# EAGLE schematic Beacon_schematic (EAGLE 9.1.3)
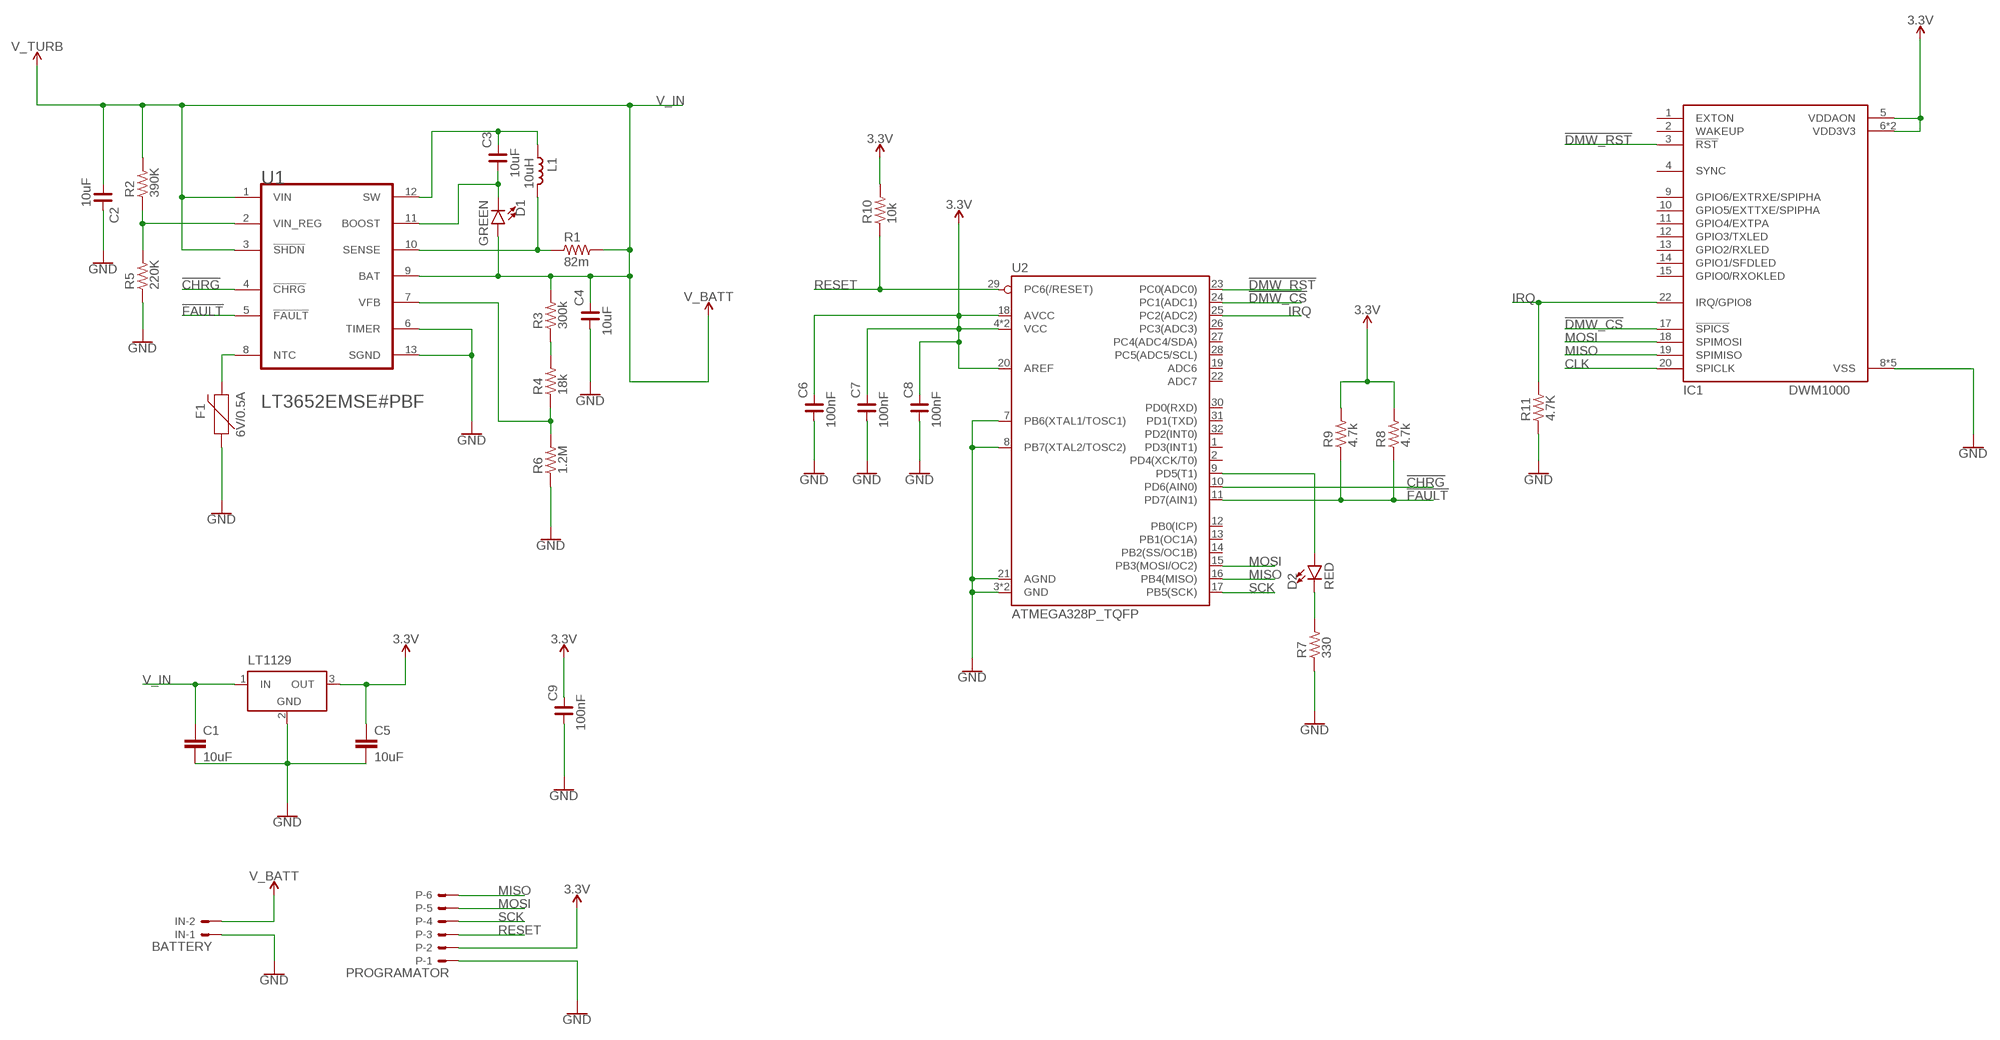
[diagram p0: schematic, sheet 1]

## Parts
C1  10uF  10UF-1206-6.3V-20%  [1206]
C2  10uF  C_1206  [C1206]
C3  10uF  C_1206  [C1206]
C4  10uF  C_1206  [C1206]
C5  10uF  10UF-1206-6.3V-20%  [1206]
C6  100nF  C_1206  [C1206]
C7  100nF  C_1206  [C1206]
C8  100nF  C_1206  [C1206]
C9  100nF  C_1206  [C1206]
D1  GREEN  LED-GREEN1206  [LED-1206]
D2  RED  LED-RED1206  [LED-1206]
F1  6V/0.5A  PPTC_HALF-AMP  [1206]
IC1  DWM1000  [DWM1000]
IN  BATTERY  JST-XH-02-PIN-LONG-PAD  [JST-XH-02-PACKAGE-LONG-PAD]
L1  10uH  L_1206  [L1206]
LT1129  LT1129CST5  [SOT223]
P  PROGRAMATOR  JST-XH-06-PIN-LONG-PAD  [JST-XH-06-PACKAGE-LONG-PAD]
R1  82m  R_1206  [R1206]
R2  390K  R_1206  [R1206]
R3  300k  R_1206  [R1206]
R4  18k  R_1206  [R1206]
R5  220K  R_1206  [R1206]
R6  1.2M  R_1206  [R1206]
R7  330  R_1206  [R1206]
R8  4.7k  R_1206  [R1206]
R9  4.7k  R_1206  [R1206]
R10  10k  R_1206  [R1206]
R11  4.7K  R_1206  [R1206]
U1  LINEAR_TECHNOLOGY_LT3652EMSE#PBFLINEAR_TECHNOLOGY_LT3652EMSE#PBF_0_2  [LINEAR_TECHNOLOGY_LT3652EMSE#PBF_2]
U2  ATMEGA328P_TQFP  [TQFP32-08]

## Nets
3.3V: C5.1 C6.2 C7.2 C8.2 C9.2 IC1.5(VDDAON) IC1.6(VDD3V3) IC1.7(VDD3V3) LT1129.3(OUT) P.2 R8.2 R9.2 R10.2 U2.4(VCC) U2.6(VCC) U2.18(AVCC) U2.20(AREF)
!CHRG: U1.4(!CHRG!) U2.10(PD6(AIN0))
!DMW_CS: IC1.17(!SPICS) U2.24(PC1(ADC1))
!DMW_RST: IC1.3(!RST) U2.23(PC0(ADC0))
!FAULT: R8.1 R9.1 U1.5(!FAULT!) U2.11(PD7(AIN1))
CLK: IC1.20(SPICLK)
GND: C1.2 C2.2 C4.1 C5.2 C6.1 C7.1 C8.1 C9.1 F1.1 IC1.8(VSS) IC1.16(VSS) IC1.21(VSS) IC1.23(VSS) IC1.24(VSS) IN.1 LT1129.2(GND) P.1 R5.1 R6.1 R7.1 R11.1 U1.6(TIMER) U1.13(SGND) U2.3(GND) U2.5(GND) U2.7(PB6(XTAL1/TOSC1)) U2.8(PB7(XTAL2/TOSC2)) U2.21(AGND)
IRQ: IC1.22(IRQ/GPIO8) R11.2 U2.25(PC2(ADC2))
MISO: IC1.19(SPIMISO) P.6 U2.16(PB4(MISO))
MOSI: IC1.18(SPIMOSI) P.5 U2.15(PB3(MOSI/OC2))
N$1: C3.2 L1.2 U1.12(SW)
N$2: C3.1 D1.C U1.11(BOOST)
N$3: D2.C R7.2
N$4: R4.1 R6.2 U1.7(VFB)
N$5: R3.1 R4.2
N$6: L1.1 R1.1 U1.10(SENSE)
N$8: F1.2 U1.8(NTC)
N$9: R2.1 R5.2 U1.2(VIN_REG)
N$12: D2.A U2.9(PD5(T1))
RESET: P.3 R10.1 U2.29(PC6(/RESET))
SCK: P.4 U2.17(PB5(SCK))
V_IN: C1.1 C2.1 C4.2 D1.A LT1129.1(IN) R1.2 R2.2 R3.2 U1.1(VIN) U1.3(!SHDN!) U1.9(BAT) ; supply symbol labelled V_TURB, V_BATT
VCC: IN.2 ; supply symbol labelled V_BATT
Unconnected: IC1.1(EXTON) IC1.2(WAKEUP) IC1.4(SYNC) IC1.9(GPIO6/EXTRXE/SPIPHA) IC1.10(GPIO5/EXTTXE/SPIPHA) IC1.11(GPIO4/EXTPA) IC1.12(GPIO3/TXLED) IC1.13(GPIO2/RXLED) IC1.14(GPIO1/SFDLED) IC1.15(GPIO0/RXOKLED) U2.1(PD3(INT1)) U2.2(PD4(XCK/T0)) U2.12(PB0(ICP)) U2.13(PB1(OC1A)) U2.14(PB2(SS/OC1B)) U2.19(ADC6) U2.22(ADC7) U2.26(PC3(ADC3)) U2.27(PC4(ADC4/SDA)) U2.28(PC5(ADC5/SCL)) U2.30(PD0(RXD)) U2.31(PD1(TXD)) U2.32(PD2(INT0))

## Power pins joined to a net without a drawn wire
GND: LT1129.4(GND)

## Library data of the parts
C1 C5 = SparkFun-Capacitors:10UF: 10.0µF ceramic capacitors A capacitor is a passive two-terminal electrical component used to store electrical energy temporarily in an electric field.; PROD_ID: CAP-10057
C2-C4 C6-C9 = rc-master-smd:C_: NON-POLARIZED CAP
D1 = SparkFun-LED:LED-GREEN: Green SMD LED Used in manufacturing of various products at SparkFun Packages: 0603 - SMD 0603 package [Product Link] <http://www.futureelectronics.com/en/technologies/semiconductors/optoelectronics/leds/Pages/9894312-LTST-C190GKT.aspx?CrossPart=HSMG-C190&IM=0> LilyPad 1206 - SMD1206 LilyPad package [Product Link] <http://www.futureelectronics.com/en/Technologies/Product.aspx?ProductID=IN150NGHARVATEKCORPORATION2049943&IM=0> 1206 - SMD1206 package [Product Link] <http://www.futureelectronics.com/en/technologies/semiconductors/optoelectronics/leds/Pages/8315665-LTST-C150KGKT.aspx?IM=0> 1206 Bottom Mount -SMD 1206 Bottom Mount [Product Link] <http://www.digikey.com/product-detail/en/lite-on-inc/LTST-C230KGKT/160-1456-1-ND/386854> SparkFun Products: Pro Mini 328 -5V <https://www.sparkfun.com/products/821> RedBoard <https://www.sparkfun.com/products/12757> MP3 Trigger <https://www.sparkfun.com/products/13720> Makey Makey <https://www.sparkfun.com/products/11076>; PROD_ID: DIO-00862
D2 = SparkFun-LED:LED-RED: Red SMD LED Used in manufacturing of most products at SparkFun Packages: 0603 - SMD 0603 package [Product Link] <http://docs.avagotech.com/docs/AV02-0551EN> 0603 SMART - SMD 0603 SMART package ( more efficient and expensive)[Product Link] <http://www.osram-os.com/Graphics/XPic2/00077099_0.pdf> 1206 - SMD1206 package [Product Link] <https://www.sparkfun.com/datasheets/DevTools/LilyPad/Q150OVS4.pdff> SparkFun Products: Pro Mini 328 -5V <https://www.sparkfun.com/products/821> RedBoard <https://www.sparkfun.com/products/12757> IOIO-OTG <https://www.sparkfun.com/products/13613>; PROD_ID: DIO-09912
F1 = SparkFun-Fuses:PPTC: Resettable Fuse PPTC Resettable Fuse. Really a sort of resistor with a polymeric positive temperature coefficient whose resistance increases dramatically with an increase in temperature. When heated by the power passing through the resistance rises causing the current to be limited, protecting the circuit. This is achieved by the transition of the polymer from a crystalline to an amorphous state where the conductive carbon separates breaking the conductive pathways found in the cool crystalline structure. When a PPTC cools back down it resumes conducting letting the circuit turn back on. SparkFun Products: SparkFun RedBoard - Programmed with Arduino <https://www.sparkfun.com/products/12757> Pro Micro - 5V/16MHz <https://www.sparkfun.com/products/12640> Arduino Pro 328 - 5V/16MHz <https://www.sparkfun.com/products/10915> MP3 Trigger <https://www.sparkfun.com/products/13720>; PROD_ID: RES-08585
IC1 = decawave:DWM1000
IN = Rembrandt Electronics - JST XH Connectors v1-0:JST-XH-02-PIN: JST XH Connector 2 Pin Wire to board connector. Pitch: 2,54 mm, (0.100") Number of pins: 2 Created by Rembrandt Electronics www.rembrandtelectronics.com
L1 = rc-master-smd:L_: INDUCTOR
LT1129 = linear-technology-2:LT1129CST5: VOLTAGE REGULATOR with shutdown
P = Rembrandt Electronics - JST XH Connectors v1-0:JST-XH-06-PIN: JST XH Connector 2 Pin Wire to board connector. Pitch: 2,54 mm, (0.100") Number of pins: 6 Created by Rembrandt Electronics www.rembrandtelectronics.com
R1-R11 = rc-master-smd:R_: RESISTOR
U1 = Linear Technology - LT3652EMSE#PBF:LINEAR_TECHNOLOGY_LT3652EMSE#PBF: LT-LT3652-MSE-12_3652HV-DD-12; CIIVA_IDS: 961002; COMPONENT_LINK_1_DESCRIPTION: Manufacturer URL; COMPONENT_LINK_1_URL: http://www.linear.com/; COMPONENT_LINK_3_DESCRIPTION: Package Specification; COMPONENT_LINK_3_URL: http://cds.linear.com/docs/en/packaging/05081666_G_MSE12.pdf; DATASHEET: http://cds.linear.com/docs/en/datasheet/3652fd.pdf; DATASHEET_VERSION: Rev. D; ENERGY_SOURCE: Solar; FOOTPRINT_VARIANT_NAME_0: Level C; FOOTPRINT_VARIANT_NAME_1: Level B; FOOTPRINT_VARIANT_NAME_2: Level A; IMPORTED: yes; IMPORTED_FROM: vault; IMPORT_TS: 1521844053; MF: Linear Technology; MOUNTING_TECHNOLOGY: Surface Mount; MPN: LT3652EMSE#PBF; NUMBER_OF_OUTPUTS: 1; PACKAGE: MSE-12-EDP; PACKAGE_DESCRIPTION: 12-Pin Plastic MSOP, Exposed Die Pad, Body 4.039 x 3 mm, Pitch 0.65 mm; PACKAGE_VERSION: Rev. G, 05/2013; PREFIX: U; RELEASE_DATE: 1377780764; ROHS: Yes; TOPOLOGY: Battery Charger; VAULT_GUID: 6335907F-6792-471E-8A4B-9897BC77EE62; VAULT_REVISION: 87FFC44D-BFD3-413F-A5A9-3E2F32EB637F; VIN_MAXV: 32; VIN_MINV: 4.95
U2 = SparkFun-IC-Microcontroller:ATMEGA328P_TQFP: Popular 328P in QFP Storefront component: ATmega328 - TQFP <https://www.sparkfun.com/products/13448> (COM-13448) Datasheet <http://www.sparkfun.com/datasheets/Components/SMD/ATMega328.pdf> SparkFun Products SparkFun RedBoard - Programmed with Arduino <https://www.sparkfun.com/products/12757> (DEV-12757) Arduino Pro Mini 328 - 5V/16MHz <https://www.sparkfun.com/products/11113> (DEV-11113) Arduino Pro Mini 328 - 3.3V/8MHz <https://www.sparkfun.com/products/11114> (DEV-11114) SparkFun OpenLog <https://www.sparkfun.com/products/13712> (DEV-13712) SparkFun MicroView - OLED Arduino Module <https://www.sparkfun.com/products/12923> (DEV-12923) SparkFun Digital Sandbox <https://www.sparkfun.com/products/12651> (DEV-12651) SparkFun PicoBoard <https://www.sparkfun.com/products/11888> (WIG-11888) Arduino Fio <https://www.sparkfun.com/products/10116> (DEV-10116) LilyPad Arduino 328 Main Board <https://www.sparkfun.com/products/13342> (DEV-13342) SparkFun RedStick <https://www.sparkfun.com/products/13741> (DEV-13741) LilyPad MP3 <https://www.sparkfun.com/products/11013> (DEV-11013) LilyPad Arduino SimpleSnap <https://www.sparkfun.com/products/10941> (DEV-10941) SparkFun Stepoko <https://www.sparkfun.com/products/13899> (ROB-13899) SparkFun Geiger Counter <https://www.sparkfun.com/products/11345> (SEN-11345) SparkFun EL Sequencer <https://www.sparkfun.com/products/12781> (COM-12781) Arduino Pro 328 - 5V/16MHz <https://www.sparkfun.com/products/10915> (DEV-10915) CryptoCape <https://www.sparkfun.com/products/12773> (DEV-12773) SparkFun IR Thermometer Evaluation Board - MLX90614 <https://www.sparkfun.com/products/10740> (SEN-10740) SparkFun RedBot Mainboard <https://www.sparkfun.com/products/12097> (ROB-12097) Arduino Pro 328 - 3.3V/8MHz <https://www.sparkfun.com/products/10914> (DEV-10914) SparkFun Block for Intel® Edison - Arduino <https://www.sparkfun.com/products/13036> (DEV-13036) SparkFun Simon Says - Surface Mount Soldering Kit <https://www.sparkfun.com/products/10935> (KIT-10935) SparkFun 7-Segment Serial Display - Red <https://www.sparkfun.com/products/11441> (COM-11441) SparkFun 7-Segment Serial Display - White <https://www.sparkfun.com/products/11629> (COM-11629) SparkFun 7-Segment Serial Display - Yellow <https://www.sparkfun.com/products/11443> (COM-11443) SparkFun 7-Segment Serial Display - Kelly Green <https://www.sparkfun.com/products/11440> (COM-11440) SparkFun 7-Segment Serial Display - Blue <https://www.sparkfun.com/products/11442> (COM-11442) SparkFun OpenSegment Serial Display - 20mm (Blue) <https://www.sparkfun.com/products/11647> (COM-11647) SparkFun OpenSegment Serial Display - 20mm (Green) <https://www.sparkfun.com/products/11646> (COM-11646) SparkFun OpenSegment Serial Display - 20mm (White) <https://www.sparkfun.com/products/11648> (COM-11648) SparkFun OpenSegment Serial Display - 20mm (Red) <https://www.sparkfun.com/products/11644> (COM-11644) SparkFun OpenSegment Serial Display - 20mm (Yellow) <https://www.sparkfun.com/products/11645> (COM-11645) SparkFun OpenSegment Shield <https://www.sparkfun.com/products/13190> (DEV-13190); PROD_ID: IC-09069